# EAGLE design FuseBoardSchematic (EAGLE 7.5.0)
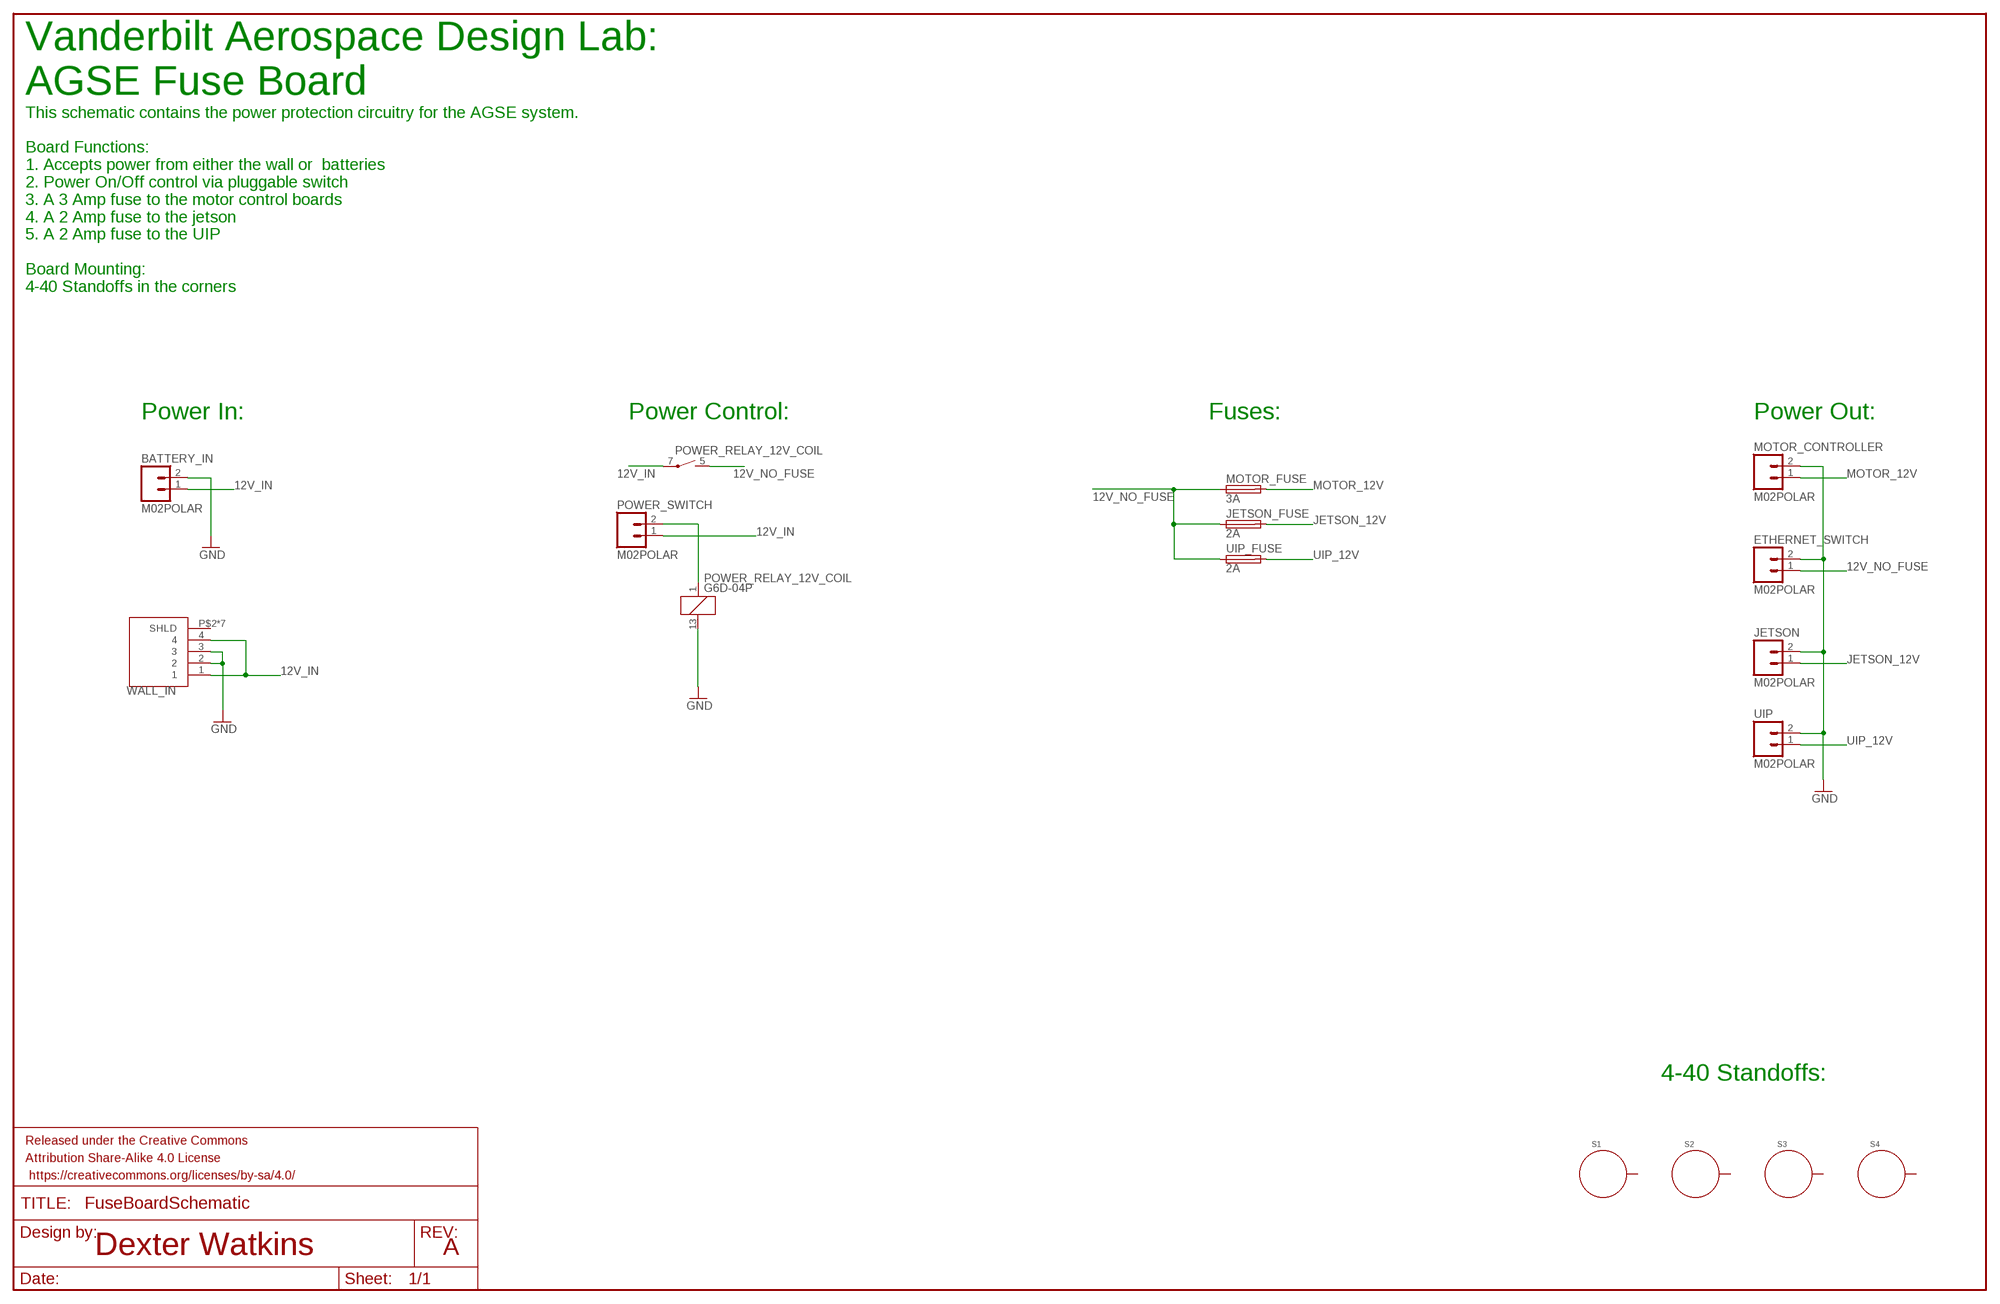
[diagram p0: schematic, sheet 1]

## Parts
BATTERY_IN  M02POLAR  [MOLEX-1X2]
ETHERNET_SWITCH  M02POLAR  [MOLEX-1X2]
FRAME1  FRAME-LEDGER  [CREATIVE_COMMONS]
JETSON  M02POLAR  [MOLEX-1X2]
JETSON_FUSE  2A  SH22,5A  [SH22,5A]
MOTOR_CONTROLLER  M02POLAR  [MOLEX-1X2]
MOTOR_FUSE  3A  SH22,5A  [SH22,5A]
POWER_RELAY_12V_COIL  G6D-04P  [G6D-SOCKET]
POWER_SWITCH  M02POLAR  [MOLEX-1X2]
S1  STANDOFF_ELECTRICAL  [STANDOFF-ELECTRICAL]
S2  STANDOFF_ELECTRICAL  [STANDOFF-ELECTRICAL]
S3  STANDOFF_ELECTRICAL  [STANDOFF-ELECTRICAL]
S4  STANDOFF_ELECTRICAL  [STANDOFF-ELECTRICAL]
UIP  M02POLAR  [MOLEX-1X2]
UIP_FUSE  2A  SH22,5A  [SH22,5A]
WALL_IN  KPJX-4S-S  [KPJX-4S-S]

## Nets
12V_IN: BATTERY_IN.1 POWER_RELAY_12V_COIL.7(2:P) POWER_SWITCH.1 WALL_IN.1 WALL_IN.4
12V_NO_FUSE: ETHERNET_SWITCH.1 JETSON_FUSE.1 MOTOR_FUSE.1 POWER_RELAY_12V_COIL.5(2:S) UIP_FUSE.1
GND: BATTERY_IN.2 ETHERNET_SWITCH.2 JETSON.2 MOTOR_CONTROLLER.2 POWER_RELAY_12V_COIL.13 UIP.2 WALL_IN.2 WALL_IN.3
JETSON_12V: JETSON.1 JETSON_FUSE.2
MOTOR_12V: MOTOR_CONTROLLER.1 MOTOR_FUSE.2
N$2: POWER_RELAY_12V_COIL.1 POWER_SWITCH.2
UIP_12V: UIP.1 UIP_FUSE.2
Unconnected: S1.P1 S2.P1 S3.P1 S4.P1 WALL_IN.P$2(SHLD) WALL_IN.P$3(SHLD) WALL_IN.P$4(SHLD) WALL_IN.P$9(SHLD) WALL_IN.P$10(SHLD) WALL_IN.P$11(SHLD) WALL_IN.SHLD

## Notes on the sheet
- Vanderbilt Aerospace Design Lab:
  AGSE Fuse Board
- This schematic contains the power protection circuitry for the AGSE system.  
  
  Board Functions:
  1. Accepts power from either the wall or  batteries
  2. Power On/Off control via pluggable switch
  3. A 3 Amp fuse to the motor control boards
  4. A 2 Amp fuse to the jetson
  5. A 2 Amp fuse to the UIP
  
  Board Mounting:
  4-40 Standoffs in the corners
- Power In: | Power Control: | Fuses: | Power Out:
- 4-40 Standoffs:
- Dexter Watkins | A

## Library data of the parts
BATTERY_IN ETHERNET_SWITCH JETSON MOTOR_CONTROLLER POWER_SWITCH UIP = SparkFun-Connectors:M02: Standard 2-pin 0.1" header. Use with - straight break away headers ( PRT-00116) - right angle break away headers (PRT-00553) - swiss pins (PRT-00743) - machine pins (PRT-00117) - female headers (PRT-00115) Molex polarized connector foot print use with: PRT-08233 with associated crimp pins and housings. 2.54_SCREWTERM for use with PRT-10571. 3.5mm Screw Terminal footprints for PRT-08084 5mm Screw Terminal footprints for use with PRT-08432
FRAME1 = SparkFun-Aesthetics:FRAME-LEDGER: Schematic Frame Standard 11x14 US Ledger frame
JETSON_FUSE MOTOR_FUSE UIP_FUSE = fuse:SH22,5A: FUSE HOLDER grid 22,5mm, isolated cap OGN0031 8201, Schurter (Buerklin); MPN: 0031.7701.11; OC_FARNELL: unknown; OC_NEWARK: 04F1224
POWER_RELAY_12V_COIL = relay:G6D?*: OMRON Slim, Miniature PCB Relay 17.5 × 6.5 × 12.5 mm with Socked Source: http://ecb.omron.com.sg/pdf/relay/power/G6D.pdf; OC_FARNELL: unknown; OC_NEWARK: unknown
S1-S4 = SparkFun-Electromechanical:STANDOFF_ELECTRICAL: A standoff intended to be an electrically connected point. Pad size and stop size allow for a #4 Phillips pan screw head to make a solid connection to the board.
WALL_IN = KPJX:KPJX-4S-S

## Board
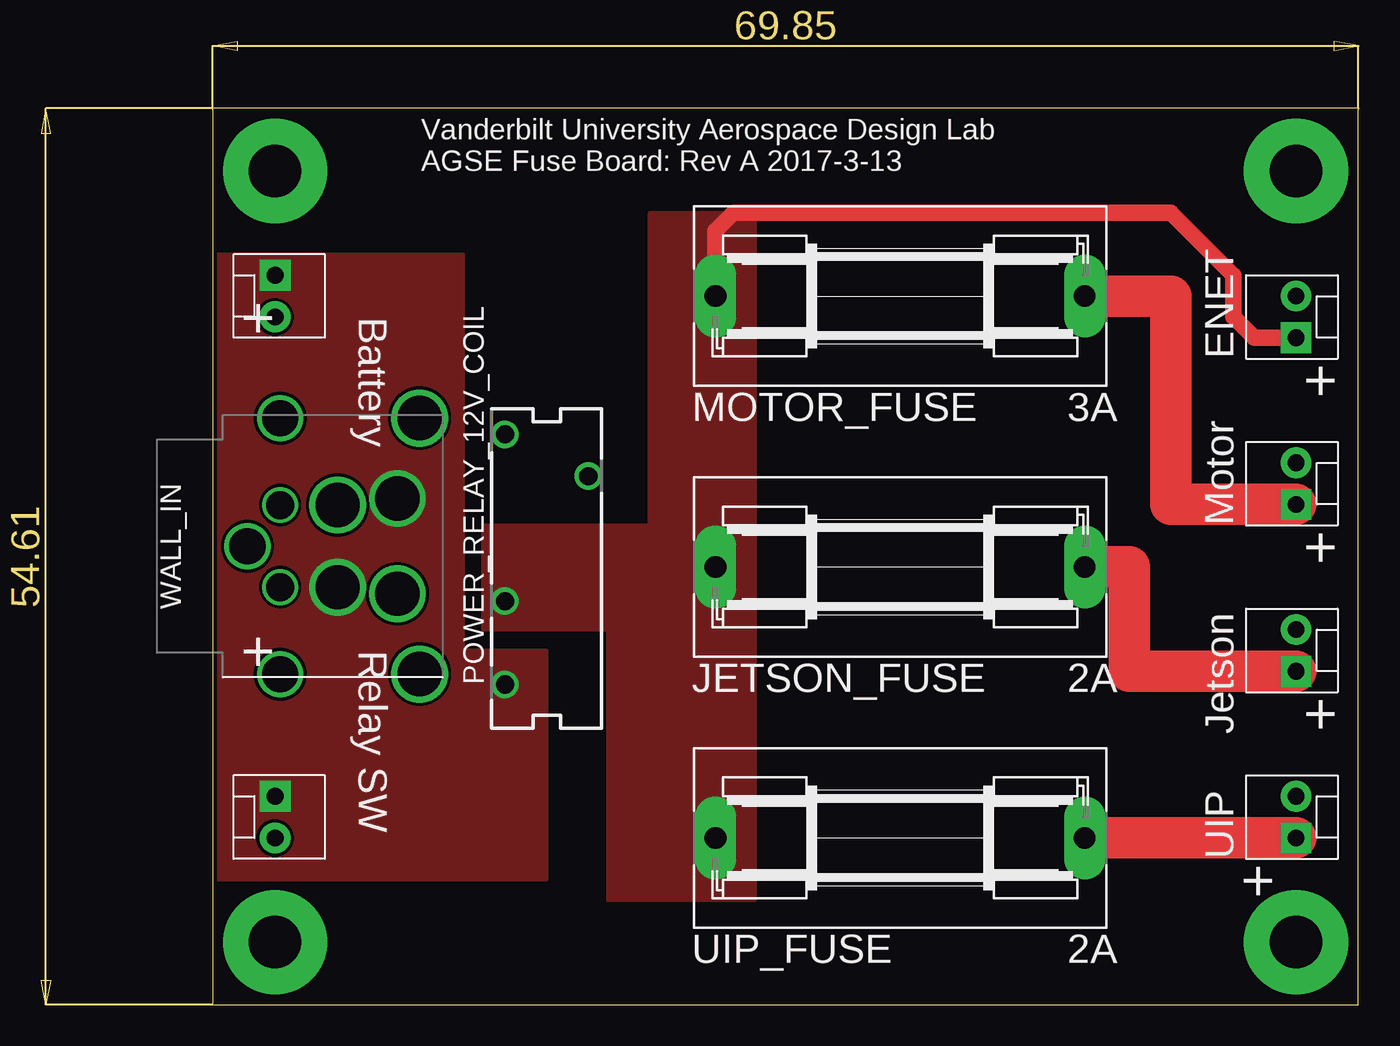
[diagram p1: board, top side]
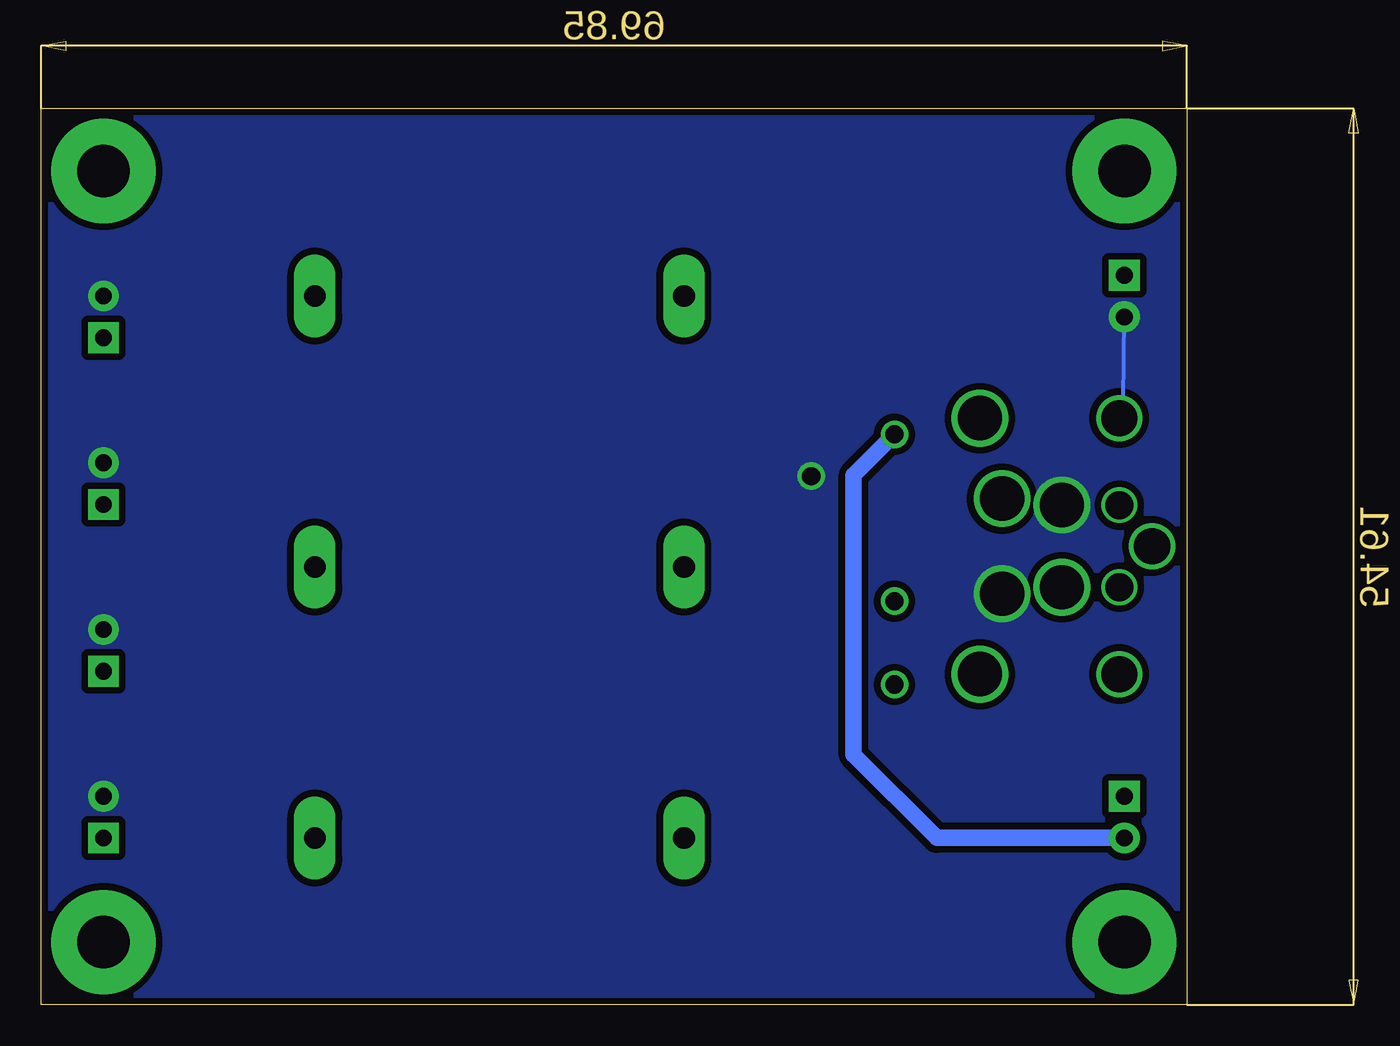
[diagram p2: board, bottom side, seen from below]

Size 69.85 x 54.61 mm. Coordinates in mm from the lower left corner, seen from the top.
Outline: 0,0 69.85,0 69.85,54.61 0,54.61 0,0
Copper layers (1*16): Top 0.035mm / dielectric 1.5mm / Bottom 0.035mm
Design rules "SparkFun *": minimum track width 8mil, minimum drill 20mil, track to track 8mil, track to pad 8mil, pad to pad 8mil, via to via 8mil, smd to smd 8mil, copper to edge 10mil, drill to drill 8mil, minimum pad ring 6mil, minimum via ring 10mil, stop-mask expansion 4mil, vias tented up to drill 25mil, thermal gap 10mil

### Footprints (pad centres in the part's own frame; a part is rotated, then mirrored left to right if it is on the bottom)
MOLEX-1X2 = drill 1.016 pad 1.88 square: 1 0,0 | drill 1.016 pad 1.88: 2 2.54,0
SH22,5A = drill 1.321 pad 2.54 long: 1 -11.252,0; 2 11.252,0
G6D-SOCKET = drill 1.1 pad 1.676: 1 8.08,2.5; 5 -2.08,2.5; 7 -7.16,2.5; 13 5.54,-2.58
STANDOFF-ELECTRICAL = drill 3.2 pad 6.35: P1 0,0
KPJX-4S-S = drill 2.7 pad 2.9: 1 2.9,-3.65; 2 -2.9,-3.65; 3 2.5,0; 4 -2.5,0 | drill 2.2: P$2 7.8,3.5; P$11 0,5.5; SHLD -7.8,3.5 | drill 1.7: P$3 -2.5,3.5; P$4 2.5,3.5 | drill 2.7: P$9 -7.8,-5; P$10 7.8,-5

### Placement (x,y rotation side)
BATTERY_IN  3.81,44.45 270 top
ETHERNET_SWITCH  66.04,40.64 90 top
FRAME1  21.59,-7.62 0 top  (outside the outline)
JETSON  66.04,20.32 90 top
JETSON_FUSE  41.91,26.67 0 top
MOTOR_CONTROLLER  66.04,30.48 90 top
MOTOR_FUSE  41.91,43.18 0 top
POWER_RELAY_12V_COIL  20.32,26.67 90 top
POWER_SWITCH  3.81,12.7 270 top
S1  3.81,3.81 0 top
S2  66.04,3.81 0 top
S3  3.81,50.8 0 top
S4  66.04,50.8 0 top
UIP  66.04,10.16 90 top
UIP_FUSE  41.91,10.16 0 top
WALL_IN  7.62,27.94 90 top

### Tracks (layer width: path | path; a pad name or v marks a point on that pad's centre or on a via)
12V_IN
  pour Top (no thermals): 0,45.72 13.97,45.72 15.24,45.72 15.24,21.59 20.32,21.59 20.32,20.32 20.32,7.62 0,7.62
12V_NO_FUSE
  Top 1.016: MOTOR_FUSE.1 30.66,47.17 31.75,48.26 58.42,48.26 62.23,44.45 62.23,41.91 63.5,40.64 ETHERNET_SWITCH.1
  pour Top (rank 2, no thermals): 33.02,6.35 24.13,6.35 24.13,22.86 16.51,22.86 16.51,29.21 26.67,29.21 26.67,48.26 33.02,48.26
GND
  Bottom 0.254: 22.86,32.23 POWER_RELAY_12V_COIL.13 | 3.89,36.8 BATTERY_IN.2
  pour Bottom (isolate 0.406, no thermals): 0,0 0,54.61 69.85,54.61 69.85,0
JETSON_12V
  Top 2.54: JETSON_FUSE.2 55.88,26.67 55.88,20.32 JETSON.1
MOTOR_12V
  Top 2.54: MOTOR_FUSE.2 58.42,43.18 58.42,30.48 MOTOR_CONTROLLER.1
N$2
  Bottom 1.016: 17.78,34.71 POWER_RELAY_12V_COIL.1 20.32,32.25 20.32,15.24 15.24,10.16 POWER_SWITCH.2
UIP_12V
  Top 2.54: UIP_FUSE.2 UIP.1

### Text on the board
tPlace: Vanderbilt University Aerospace Design Lab / AGSE Fuse Board: Rev A 2017-3-13 | Battery | + | ENET | + | Motor | + | Relay SW | + | Jetson | + | UIP | +